# Altium schematic sheet LineCliffSensors.SchDoc
size A
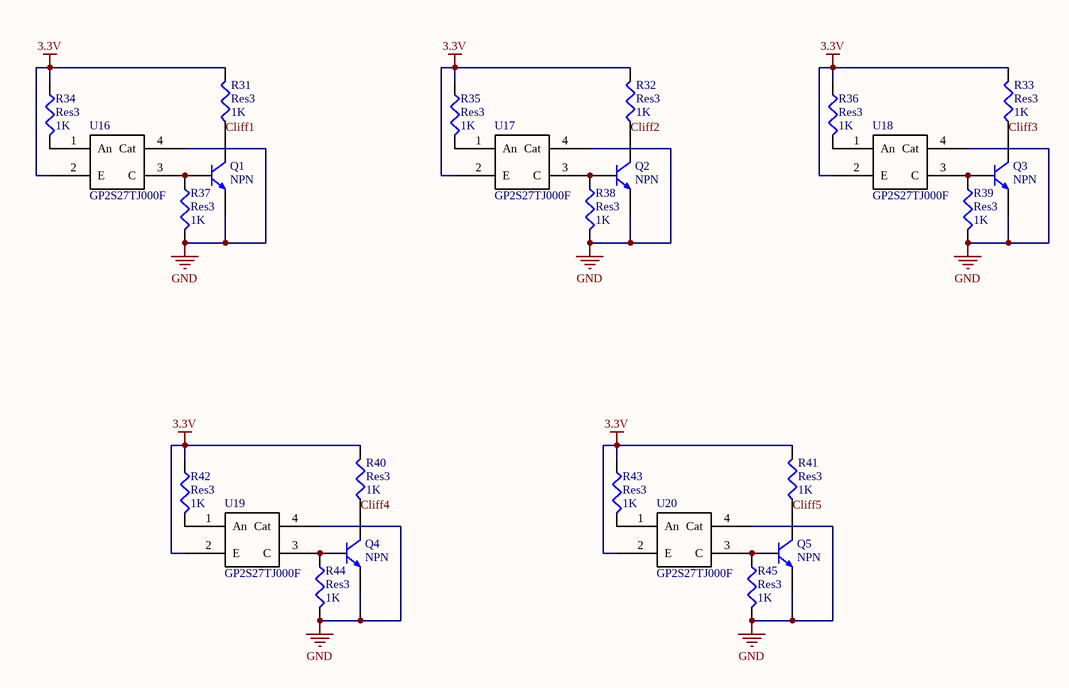
[diagram p0: LineCliffSensors.SchDoc]

## Parts
Q1  NPN  [SOT-23]
Q2  NPN  [SOT-23]
Q3  NPN  [SOT-23]
Q4  NPN  [SOT-23]
Q5  NPN  [SOT-23]
R31  Res3  value 1K  [RESC1608L]
R32  Res3  value 1K  [RESC1608L]
R33  Res3  value 1K  [RESC1608L]
R34  Res3  value 1K  [RESC1608L]
R35  Res3  value 1K  [RESC1608L]
R36  Res3  value 1K  [RESC1608L]
R37  Res3  value 1K  [RESC1608L]
R38  Res3  value 1K  [RESC1608L]
R39  Res3  value 1K  [RESC1608L]
R40  Res3  value 1K  [RESC1608L]
R41  Res3  value 1K  [RESC1608L]
R42  Res3  value 1K  [RESC1608L]
R43  Res3  value 1K  [RESC1608L]
R44  Res3  value 1K  [RESC1608L]
R45  Res3  value 1K  [RESC1608L]
U16  GP2S27TJ000F  [GP2S27J0000F]
U17  GP2S27TJ000F  [GP2S27J0000F]
U18  GP2S27TJ000F  [GP2S27J0000F]
U19  GP2S27TJ000F  [GP2S27J0000F]
U20  GP2S27TJ000F  [GP2S27J0000F]

## Nets
3.3V: R31.2 R32.2 R33.2 R34.1 R35.1 R36.1 R40.2 R41.2 R42.1 R43.1 U16.2(E) U17.2(E) U18.2(E) U19.2(E) U20.2(E)
GND: Q1.2(E) Q2.2(E) Q3.2(E) Q4.2(E) Q5.2(E) R37.2 R38.2 R39.2 R44.2 R45.2 U16.4(Cat) U17.4(Cat) U18.4(Cat) U19.4(Cat) U20.4(Cat)
Cliff1: Q1.3(C) R31.1
Cliff2: Q2.3(C) R32.1
Cliff3: Q3.3(C) R33.1
Cliff4: Q4.3(C) R40.1
Cliff5: Q5.3(C) R41.1
NetQ1_1: Q1.1(B) R37.1 U16.3(C)
NetQ2_1: Q2.1(B) R38.1 U17.3(C)
NetQ3_1: Q3.1(B) R39.1 U18.3(C)
NetQ4_1: Q4.1(B) R44.1 U19.3(C)
NetQ5_1: Q5.1(B) R45.1 U20.3(C)
NetR34_2: R34.2 U16.1(An)
NetR35_2: R35.2 U17.1(An)
NetR36_2: R36.2 U18.1(An)
NetR42_2: R42.2 U19.1(An)
NetR43_2: R43.2 U20.1(An)

## Library data of the parts
R31-R45 = Res3: Resistor; Published: 8-Jun-2000; LatestRevisionDate: 29-May-2009; LatestRevisionNote: IPC-7351 Footprint Added.; PackageReference: J1-0603; Publisher: Altium Limited; PackageDescription: Chip Resistor